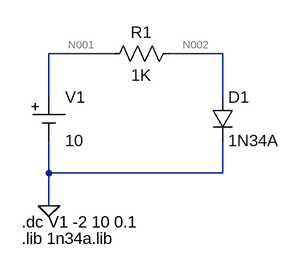
[diagram p0: schematic simulacionDiodo1N60.asc]
simulacionDiodo1N60.asc, the LTspice schematic file:
Version 4.1
SHEET 1 1644 680
WIRE 304 80 208 80
WIRE 464 80 384 80
WIRE 208 144 208 80
WIRE 464 144 464 80
WIRE 208 256 208 208
WIRE 464 256 464 208
WIRE 464 256 208 256
WIRE 208 304 208 256
FLAG 208 304 0
SYMBOL Misc\\cell 208 144 R0
WINDOW 123 0 0 Left 0
WINDOW 39 0 0 Left 0
SYMATTR InstName V1
SYMATTR Value 10
SYMBOL res 400 64 R90
WINDOW 0 0 56 VBottom 2
WINDOW 3 32 56 VTop 2
SYMATTR InstName R1
SYMATTR Value 1K
SYMBOL diode 448 144 R0
SYMATTR InstName D1
SYMATTR Value 1N34A
TEXT 168 328 Left 2 !.dc V1 -2 10 0.1
TEXT 168 352 Left 2 !.lib 1n34a.lib

The netlist it stands for:
* simulacionDiodo1N60.asc
V1 N001 0 10
R1 N002 N001 1K
D1 N002 0 1N34A
.model D D
.lib standard.dio
.dc V1 -2 10 0.1
.lib 1n34a.lib
.backanno
.end

* Results of the author's LTspice run, read from the files saved beside the schematic
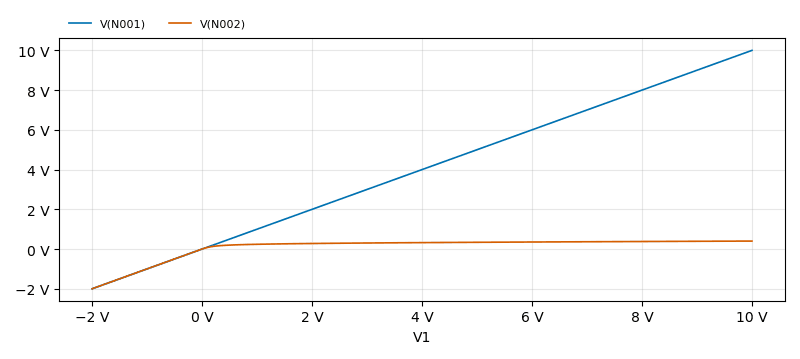
[diagram p1: DC transfer characteristic of simulacionDiodo1N60.asc, plotted from the saved traces]
* DC transfer characteristic, 1 run:
*   V(N001): -2 V at V1=-2 V, 10 V at V1=10 V, min -2 V, max 10 V
*   V(N002): -1.997 V at V1=-2 V, 402.3 mV at V1=10 V, min -1.997 V, max 402.3 mV